# Altium schematic sheet MCU.SchDoc
size A3; Revision: B.2(PCB.SCH)
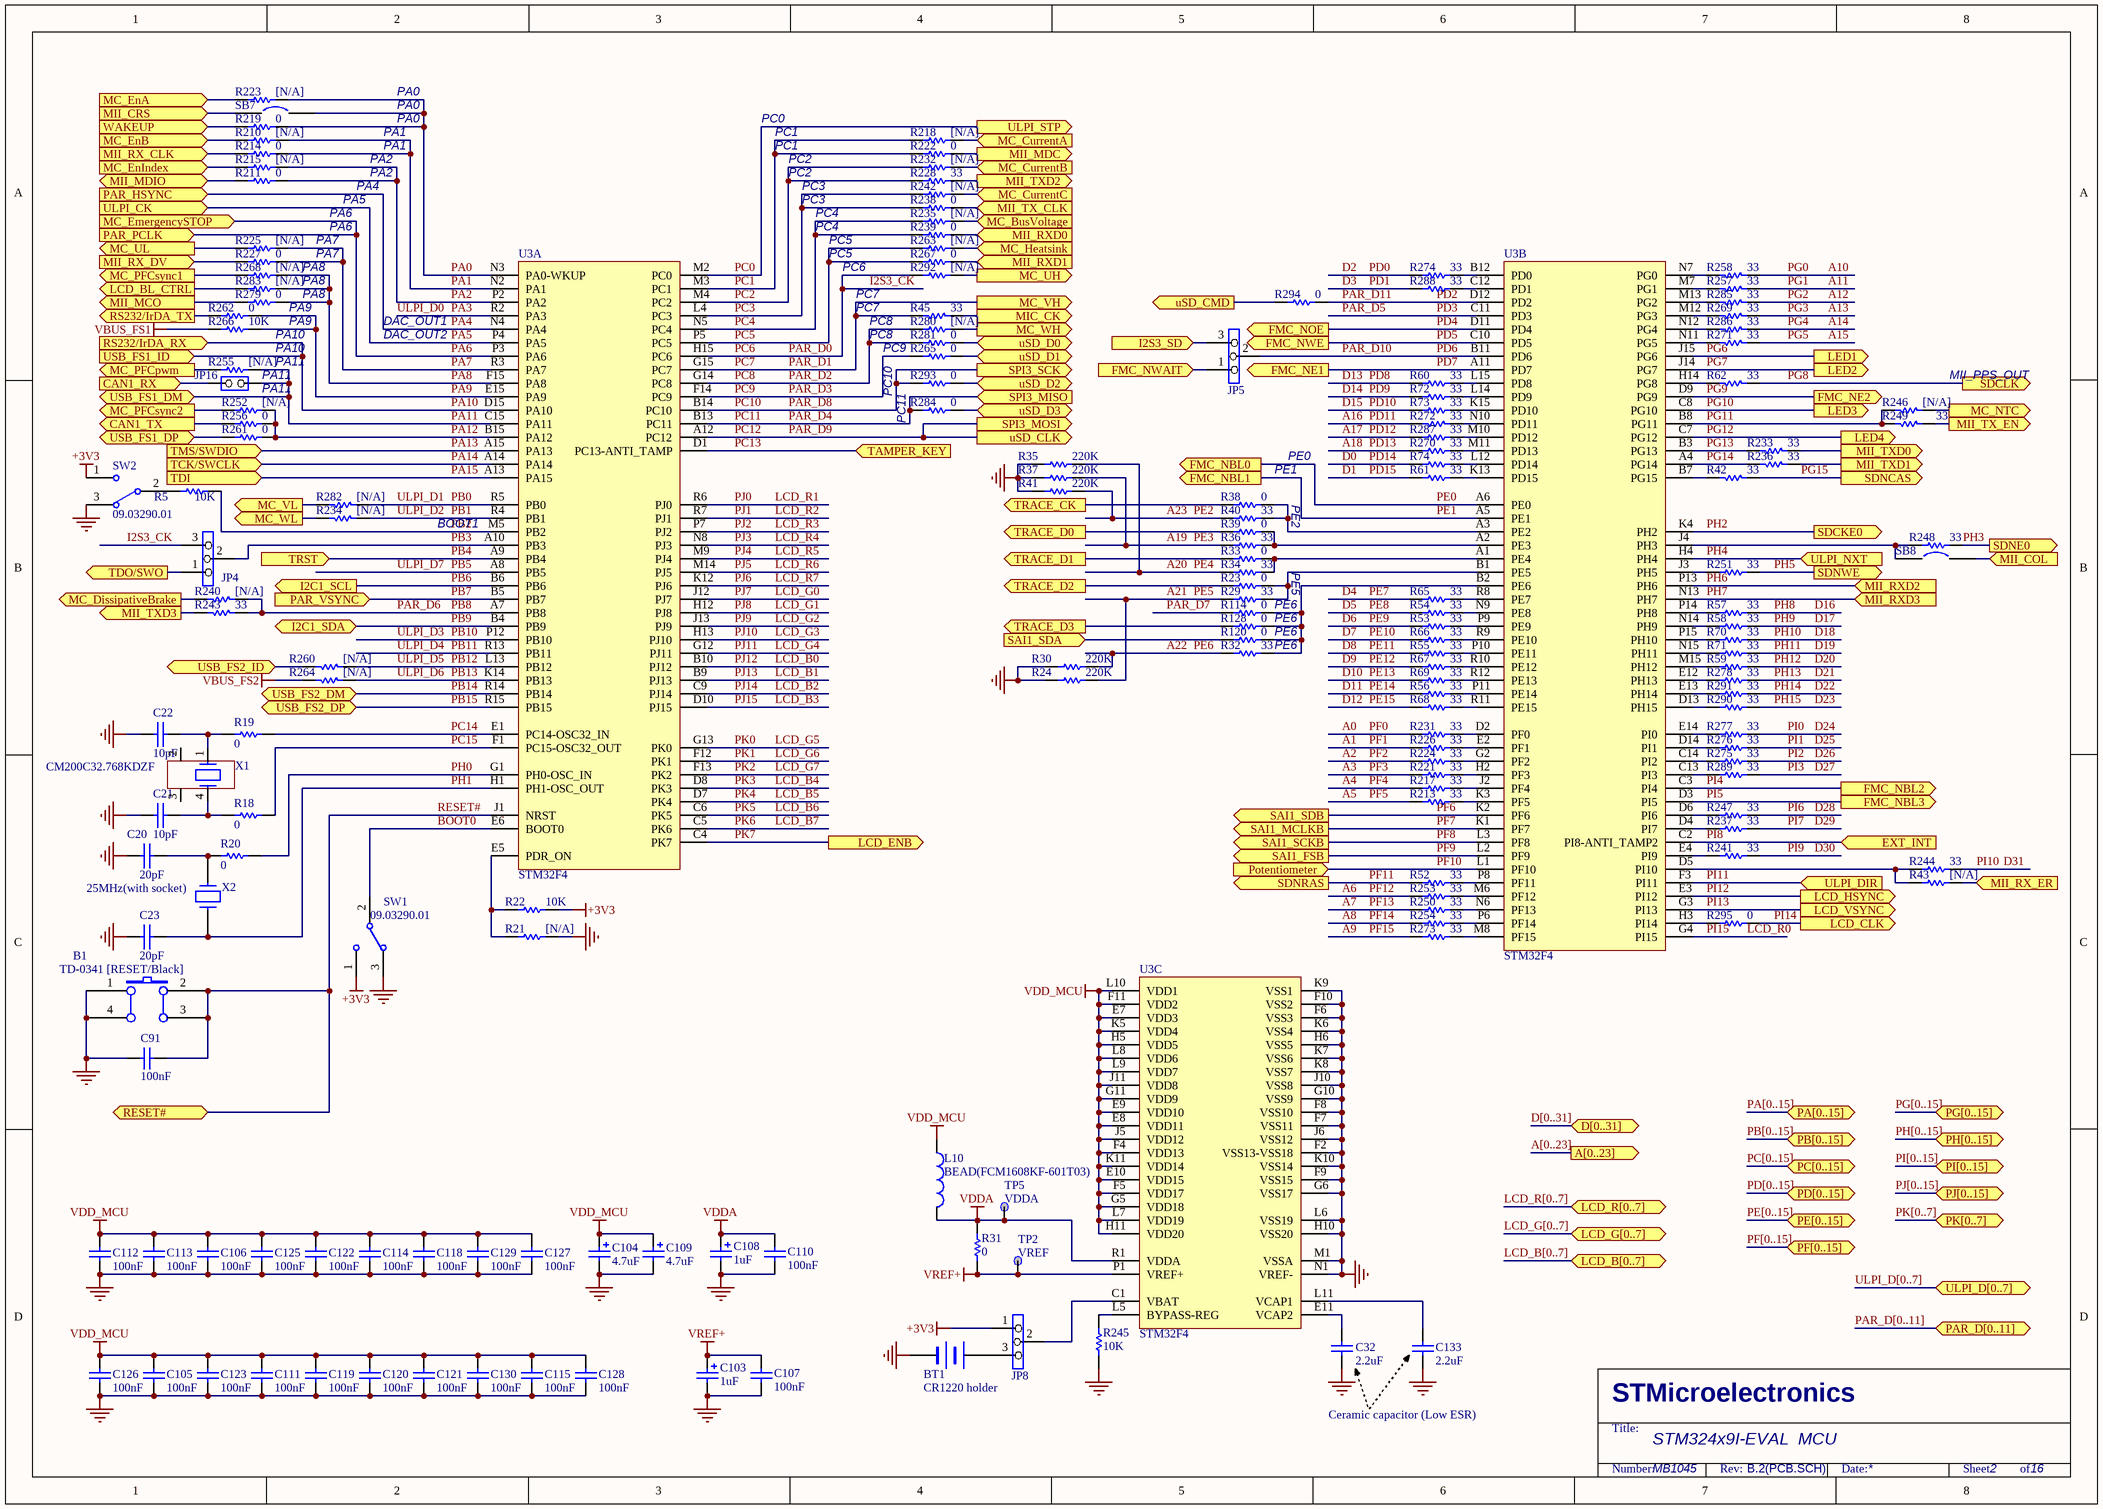
[diagram p0: MCU.SchDoc]

## Parts
B1  TD-0341 [RESET/Black]  [PB10]
BT1  CR1220 holder  [BAT_2SM_CR1220]
C20  20pF  [0603C]
C21  10pF  [0603C]
C22  10pF  [0603C]
C23  20pF  [0603C]
C32  2.2uF  [1206C]
C91  100nF  [0603C]
C103  1uF  [TAN-A]
C104  4.7uF  [TAN-A]
C105  100nF  [0402C]
C106  100nF  [0402C]
C107  100nF  [0402C]
C108  1uF  [TAN-A]
C109  4.7uF  [TAN-A]
C110  100nF  [0402C]
C111  100nF  [0402C]
C112  100nF  [0402C]
C113  100nF  [0402C]
C114  100nF  [0402C]
C115  100nF  [0402C]
C118  100nF  [0402C]
C119  100nF  [0402C]
C120  100nF  [0402C]
C121  100nF  [0402C]
C122  100nF  [0402C]
C123  100nF  [0402C]
C125  100nF  [0402C]
C126  100nF  [0402C]
C127  100nF  [0402C]
C128  100nF  [0402C]
C129  100nF  [0402C]
C130  100nF  [0402C]
C133  2.2uF  [1206C]
JP4  (no value)  [SIP3]
JP5  (no value)  [SIP3]
JP8  (no value)  [SIP3]
JP16  (no value)  [SIP2]
L10  BEAD(FCM1608KF-601T03)  [0603L]
R5  10K  [0603R]
R18  0  [0603R]
R19  0  [0603R]
R20  0  [0603R]
R21  [N/A]  [0603R]
R22  10K  [0603R]
R23  0  [0603R]
R24  220K  [0603R]
R29  33  [0402R]
R30  220K  [0603R]
R31  0  [0603R]
R32  33  [0402R]
R33  0  [0603R]
R34  33  [0402R]
R35  220K  [0603R]
R36  33  [0402R]
R37  220K  [0603R]
R38  0  [0603R]
R39  0  [0603R]
R40  33  [0402R]
R41  220K  [0603R]
R42  33  [0402R]
R43  [N/A]  [0603R]
R45  33  [0603R]
R52  33  [0402R]
R53  33  [0402R]
R54  33  [0402R]
R55  33  [0402R]
R56  33  [0402R]
R57  33  [0402R]
R58  33  [0402R]
R59  33  [0402R]
R60  33  [0402R]
R61  33  [0402R]
R62  33  [0402R]
R65  33  [0402R]
R66  33  [0402R]
R67  33  [0402R]
R68  33  [0402R]
R69  33  [0402R]
R70  33  [0402R]
R71  33  [0402R]
R72  33  [0402R]
R73  33  [0402R]
R74  33  [0402R]
R114  0  [0603R]
R120  0  [0603R]
R128  0  [0603R]
R210  [N/A]  [0603R]
R211  0  [0603R]
R213  33  [0402R]
R214  0  [0603R]
R215  [N/A]  [0603R]
R217  33  [0402R]
R218  [N/A]  [0603R]
R219  0  [0603R]
R221  33  [0402R]
R222  0  [0603R]
R223  [N/A]  [0603R]
R224  33  [0402R]
R225  [N/A]  [0603R]
R226  33  [0402R]
R227  0  [0603R]
R228  33  [0603R]
R231  33  [0402R]
R232  [N/A]  [0603R]
R233  33  [0603R]
R234  [N/A]  [0603R]
R235  [N/A]  [0603R]
R236  33  [0603R]
R237  33  [0402R]
R238  0  [0603R]
R239  0  [0603R]
R240  [N/A]  [0603R]
R241  33  [0402R]
R242  [N/A]  [0603R]
R243  33  [0603R]
R244  33  [0402R]
R245  10K  [0603R]
R246  [N/A]  [0603R]
R247  33  [0402R]
R248  33  [0402R]
R249  33  [0603R]
R250  33  [0402R]
R251  33  [0402R]
R252  [N/A]  [0603R]
R253  33  [0402R]
R254  33  [0402R]
R255  [N/A]  [0603R]
R256  0  [0603R]
R257  33  [0402R]
R258  33  [0402R]
R260  [N/A]  [0603R]
R261  0  [0603R]
R262  0  [0603R]
R263  [N/A]  [0603R]
R264  [N/A]  [0603R]
R265  0  [0603R]
R266  10K  [0603R]
R267  0  [0603R]
R268  [N/A]  [0603R]
R269  33  [0402R]
R270  33  [0402R]
R271  33  [0402R]
R272  33  [0402R]
R273  33  [0402R]
R274  33  [0402R]
R275  33  [0402R]
R276  33  [0402R]
R277  33  [0402R]
R278  33  [0402R]
R279  0  [0603R]
R280  [N/A]  [0603R]
R281  0  [0603R]
R282  [N/A]  [0603R]
R283  [N/A]  [0603R]
R284  0  [0603R]
R285  33  [0402R]
R286  33  [0402R]
R287  33  [0402R]
R288  33  [0402R]
R289  33  [0402R]
R290  33  [0402R]
R291  33  [0402R]
R292  [N/A]  [0603R]
R293  0  [0603R]
R294  0  [0603R]
R295  0  [0603R]
SB7  (no value)  [JP2_SMD]
SB8  (no value)  [JP2_SMD]
SW1  09.03290.01  [SW1_3TH_2R54_10X2R5]
SW2  09.03290.01  [SW1_3TH_2R54_10X2R5]
TP2  VREF  [TP]
TP5  VDDA  [TP]
U3  STM32F4  [BGA216_0R8_13X13_SKT]  (parts A,B,C of 3)
X1  CM200C32.768KDZF  [XTAL_4SM_8X3R8]
X2  25MHz(with socket)  [XTAL_socket]

## Ports
A[0..23] (out), CAN1_RX (in), CAN1_TX (out), D[0..31] (bidir), EXT_INT (in), FMC_NBL0 (out), FMC_NBL1 (out), FMC_NBL2 (out), FMC_NBL3 (out), FMC_NE1 (out), FMC_NE2 (out), FMC_NOE (out), FMC_NWAIT (in), FMC_NWE (out), I2C1_SCL (out), I2C1_SDA (bidir), I2S3_SD (in), LCD_B[0..7] (bidir), LCD_BL_CTRL (out), LCD_CLK (out), LCD_ENB (out), LCD_G[0..7] (bidir), LCD_HSYNC (out), LCD_R[0..7] (bidir), LCD_VSYNC (out), LED1 (out), LED2 (out), LED3 (out), LED4 (out), MC_BusVoltage (in), MC_CurrentA (in), MC_CurrentB (in), MC_CurrentC (in), MC_DissipativeBrake (out), MC_EmergencySTOP (in), MC_EnA (in), MC_EnB (in), MC_EnIndex (in), MC_Heatsink (in), MC_NTC (out), MC_PFCpwm (out), MC_PFCsync1 (out), MC_PFCsync2 (out), MC_UH (out), MC_UL (out), MC_VH (out), MC_VL (out), MC_WH (out), MC_WL (out), MIC_CK (out), MII_COL (in), MII_CRS (in), MII_MCO (out), MII_MDC (out), MII_MDIO (bidir), MII_RX_CLK (in), MII_RX_DV (in), MII_RX_ER (in), MII_RXD0 (in), MII_RXD1 (in), MII_RXD2 (in), MII_RXD3 (in), MII_TX_CLK (in), MII_TX_EN (out), MII_TXD0 (out), MII_TXD1 (out), MII_TXD2 (out), MII_TXD3 (out), PA[0..15] (bidir), PAR_D[0..11] (bidir), PAR_HSYNC (in), PAR_PCLK (in), PAR_VSYNC (in), PB[0..15] (bidir), PC[0..15] (bidir), PD[0..15] (bidir), PE[0..15] (bidir), PF[0..15] (bidir), PG[0..15] (bidir), PH[0..15] (bidir), PI[0..15] (bidir), PJ[0..15] (bidir), PK[0..7] (bidir), Potentiometer (in), RESET# (bidir), RS232/IrDA_RX (in), RS232/IrDA_TX (out), SAI1_FSB (out), SAI1_MCLKB (out), SAI1_SCKB (out), SAI1_SDA (in), SAI1_SDB (out), SDCKE0 (out), SDCLK (out), SDNCAS (out), SDNE0 (out), SDNRAS (out), SDNWE (out), SPI3_MISO (in), SPI3_MOSI (out), SPI3_SCK (out), TAMPER_KEY (in), TCK/SWCLK (in), TDI (in), TDO/SWO (out), TMS/SWDIO (in), TRACE_CK (out), TRACE_D0 (out), TRACE_D1 (out), TRACE_D2 (out), TRACE_D3 (out), TRST (in), ULPI_CK (in), ULPI_D[0..7] (bidir), ULPI_DIR (in), ULPI_NXT (in), ULPI_STP (out), USB_FS1_DM (bidir), USB_FS1_DP (bidir), USB_FS1_ID (in), USB_FS2_DM (bidir), USB_FS2_DP (bidir), USB_FS2_ID (bidir), uSD_CLK (out), uSD_CMD (out), uSD_D0 (bidir), uSD_D1 (bidir), uSD_D2 (bidir), uSD_D3 (bidir), WAKEUP (in)

## Nets
+3V3: JP8.1 R22.2 SW1.1 SW2.1
GND: B1.1(A0) B1.4(A1) BT1.2(-) C20.2 C21.2 C22.2 C23.2 C32.2 C91.1 C103.2 C104.2 C105.2 C106.2 C107.1 C108.2 C109.2 C110.1 C111.2 C112.2 C113.2 C114.2 C115.2 C118.2 C119.2 C120.2 C121.2 C122.2 C123.2 C125.2 C126.2 C127.2 C128.2 C129.2 C130.2 C133.2 R21.2 R24.1 R30.1 R35.1 R37.1 R41.1 R245.1 SW1.3 SW2.3 U3.F2(VSS13-VSS18) U3.F6(VSS3) U3.F7(VSS11) U3.F8(VSS10) U3.F9(VSS15) U3.F10(VSS2) U3.G6(VSS17) U3.G10(VSS9) U3.H6(VSS5) U3.H10(VSS20) U3.J6(VSS12) U3.J10(VSS8) U3.K6(VSS4) U3.K7(VSS6) U3.K8(VSS7) U3.K9(VSS1) U3.K10(VSS14) U3.L6(VSS19) U3.M1(VSSA) U3.N1(VREF-)
VBUS_FS1: R266.2
VBUS_FS2: R264.1
VDD_MCU: C104.1 C105.1 C106.1 C109.1 C111.1 C112.1 C113.1 C114.1 C115.1 C118.1 C119.1 C120.1 C121.1 C122.1 C123.1 C125.1 C126.1 C127.1 C128.1 C129.1 C130.1 L10.1 U3.E7(VDD3) U3.E8(VDD11) U3.E9(VDD10) U3.E10(VDD15) U3.F4(VDD13) U3.F5(VDD17) U3.F11(VDD2) U3.G5(VDD18) U3.G11(VDD9) U3.H5(VDD5) U3.H11(VDD20) U3.J5(VDD12) U3.J11(VDD8) U3.K5(VDD4) U3.K11(VDD14) U3.L7(VDD19) U3.L8(VDD6) U3.L9(VDD7) U3.L10(VDD1)
VDDA: C108.1 C110.2 L10.2 R31.1 TP5.1 U3.R1(VDDA)
VREF+: C103.1 C107.2 R31.2 TP2.1 U3.P1(VREF+)
A0: R231.2  [also labelled PF0]
A1: R226.2  [also labelled PF1]
A2: R224.2  [also labelled PF2]
A3: R221.2  [also labelled PF3]
A4: R217.2  [also labelled PF4]
A5: R213.2  [also labelled PF5]
A6: R253.2  [also labelled PF12]
A7: R250.2  [also labelled PF13]
A8: R254.2  [also labelled PF14]
A9: R273.2  [also labelled PF15]
A10: R258.2  [also labelled PG0]
A11: R257.2  [also labelled PG1]
A12: R285.2  [also labelled PG2]
A13: R269.2  [also labelled PG3]
A14: R286.2  [also labelled PG4]
A15: R271.2  [also labelled PG5]
A16: R272.1  [also labelled PD11]
A17: R287.2  [also labelled PD12]
A18: R270.2  [also labelled PD13]
A19: R36.2 R37.2  [also labelled PE3]
A20: R34.2 R35.2  [also labelled PE4]
A21: R24.2 R29.2  [also labelled PE5]
A22: R30.2 R32.2  [also labelled PE6]
A23: R40.2 R41.2  [also labelled PE2]
BOOT0: SW1.2 U3.E6(BOOT0)
CAN1_RX: JP16.2(NO) ; port CAN1_RX
CAN1_TX: R256.2 ; port CAN1_TX
D0: R74.2  [also labelled PD14]
D1: R61.2  [also labelled PD15]
D2: R274.2  [also labelled PD0]
D3: R288.2  [also labelled PD1]
D4: R65.2  [also labelled PE7]
D5: R54.2  [also labelled PE8]
D6: R53.2  [also labelled PE9]
D7: R66.2  [also labelled PE10]
D8: R55.2  [also labelled PE11]
D9: R67.2  [also labelled PE12]
D10: R69.2  [also labelled PE13]
D11: R56.2  [also labelled PE14]
D12: R68.2  [also labelled PE15]
D13: R60.2  [also labelled PD8]
D14: R72.2  [also labelled PD9]
D15: R73.2  [also labelled PD10]
D16: R57.1  [also labelled PH8]
D17: R58.1  [also labelled PH9]
D18: R70.1  [also labelled PH10]
D19: R71.1  [also labelled PH11]
D20: R59.1  [also labelled PH12]
D21: R278.1  [also labelled PH13]
D22: R291.1  [also labelled PH14]
D23: R290.1  [also labelled PH15]
D24: R277.1  [also labelled PI0]
D25: R276.1  [also labelled PI1]
D26: R275.1  [also labelled PI2]
D27: R289.1  [also labelled PI3]
D28: R247.1  [also labelled PI6]
D29: R237.1  [also labelled PI7]
D30: R241.1  [also labelled PI9]
D31: R244.1  [also labelled PI10]
FMC_NWAIT: JP5.1 ; port FMC_NWAIT
I2S3_CK: JP4.3 R292.2 U3.H15(PC6)  [also labelled PAR_D0, PC6]
I2S3_SD: JP5.3 ; port I2S3_SD
LCD_B0: U3.B10(PJ12)  [also labelled PJ12]
LCD_B1: U3.B9(PJ13)  [also labelled PJ13]
LCD_B2: U3.C9(PJ14)  [also labelled PJ14]
LCD_B3: U3.D10(PJ15)  [also labelled PJ15]
LCD_B4: U3.D8(PK3)  [also labelled PK3]
LCD_B5: U3.D7(PK4)  [also labelled PK4]
LCD_B6: U3.C6(PK5)  [also labelled PK5]
LCD_B7: U3.C5(PK6)  [also labelled PK6]
LCD_BL_CTRL: R283.2 ; port LCD_BL_CTRL
LCD_G0: U3.J12(PJ7)  [also labelled PJ7]
LCD_G1: U3.H12(PJ8)  [also labelled PJ8]
LCD_G2: U3.J13(PJ9)  [also labelled PJ9]
LCD_G3: U3.H13(PJ10)  [also labelled PJ10]
LCD_G4: U3.G12(PJ11)  [also labelled PJ11]
LCD_G5: U3.G13(PK0)  [also labelled PK0]
LCD_G6: U3.F12(PK1)  [also labelled PK1]
LCD_G7: U3.F13(PK2)  [also labelled PK2]
LCD_R0: U3.G4(PI15)  [also labelled PI15]
LCD_R1: U3.R6(PJ0)  [also labelled PJ0]
LCD_R2: U3.R7(PJ1)  [also labelled PJ1]
LCD_R3: U3.P7(PJ2)  [also labelled PJ2]
LCD_R4: U3.N8(PJ3)  [also labelled PJ3]
LCD_R5: U3.M9(PJ4)  [also labelled PJ4]
LCD_R6: U3.M14(PJ5)  [also labelled PJ5]
LCD_R7: U3.K12(PJ6)  [also labelled PJ6]
MC_BusVoltage: R235.1 ; port MC_BusVoltage
MC_CurrentA: R218.1 ; port MC_CurrentA
MC_CurrentB: R232.1 ; port MC_CurrentB
MC_CurrentC: R242.1 ; port MC_CurrentC
MC_DissipativeBrake: R240.1 ; port MC_DissipativeBrake
MC_EnA: R223.2 ; port MC_EnA
MC_EnB: R210.2 ; port MC_EnB
MC_EnIndex: R215.2 ; port MC_EnIndex
MC_Heatsink: R263.1 ; port MC_Heatsink
MC_NTC: R246.2 ; port MC_NTC
MC_PFCpwm: R255.2 ; port MC_PFCpwm
MC_PFCsync1: R268.2 ; port MC_PFCsync1
MC_PFCsync2: R252.2 ; port MC_PFCsync2
MC_UH: R292.1 ; port MC_UH
MC_UL: R225.2 ; port MC_UL
MC_VL: R282.1 ; port MC_VL
MC_WH: R280.1 ; port MC_WH
MC_WL: R234.1 ; port MC_WL
MIC_CK: R45.2 ; port MIC_CK
MII_COL: SB8.2 ; port MII_COL
MII_CRS: SB7.1 ; port MII_CRS
MII_MCO: R279.2 ; port MII_MCO
MII_MDC: R222.1 ; port MII_MDC
MII_MDIO: R211.2 ; port MII_MDIO
MII_RX_CLK: R214.2 ; port MII_RX_CLK
MII_RX_DV: R227.2 ; port MII_RX_DV
MII_RX_ER: R43.1 ; port MII_RX_ER
MII_RXD0: R239.1 ; port MII_RXD0
MII_RXD1: R267.1 ; port MII_RXD1
MII_TX_CLK: R238.1 ; port MII_TX_CLK
MII_TX_EN: R249.2 ; port MII_TX_EN
MII_TXD0: R233.2 ; port MII_TXD0
MII_TXD1: R236.2 ; port MII_TXD1
MII_TXD2: R228.1 ; port MII_TXD2
MII_TXD3: R243.1 ; port MII_TXD3
PA0: R219.1 R223.1 SB7.2 U3.N3(PA0-WKUP)
PA1: R210.1 R214.1 U3.N2(PA1)
PA2: R211.1 R215.1 U3.P2(PA2)
PA3: U3.R2(PA3)  [also labelled ULPI_D0]
PA4: U3.N4(PA4) ; port PAR_HSYNC
PA5: U3.P4(PA5) ; port ULPI_CK
PA6: U3.P3(PA6) ; port MC_EmergencySTOP, port PAR_PCLK
PA7: R225.1 R227.1 U3.R3(PA7)
PA8: R268.1 R279.1 R283.1 U3.F15(PA8)
PA9: R262.1 R266.1 U3.E15(PA9)
PA10: U3.D15(PA10) ; port RS232/IrDA_RX, port USB_FS1_ID
PA11: JP16.1(COMMON) R255.1 U3.C15(PA11) ; port USB_FS1_DM
PA12: R252.1 R256.1 R261.1 U3.B15(PA12)
PA13: U3.A15(PA13) ; port TMS/SWDIO
PA14: U3.A14(PA14) ; port TCK/SWCLK
PA15: U3.A13(PA15) ; port TDI
PAR_D1: R45.1 U3.G15(PC7) ; port MC_VH  [also labelled PC7]
PAR_D2: R280.2 R281.2 U3.G14(PC8)  [also labelled PC8]
PAR_D3: R265.2 U3.F14(PC9)  [also labelled PC9]
PAR_D4: R284.2 U3.B13(PC11) ; port SPI3_MISO  [also labelled PC11]
PAR_D5: U3.C11(PD3)  [also labelled PD3]
PAR_D6: R240.2 R243.2 U3.A7(PB8)  [also labelled PB8]
PAR_D7: R114.1
PAR_D8: R293.2 U3.B14(PC10) ; port SPI3_SCK  [also labelled PC10]
PAR_D9: U3.A12(PC12) ; port uSD_CLK, port SPI3_MOSI  [also labelled PC12]
PAR_D10: JP5.2 U3.B11(PD6)  [also labelled PD6]
PAR_D11: R294.2 U3.D12(PD2)  [also labelled PD2]
PB0: R282.2 U3.R5(PB0)  [also labelled ULPI_D1]
PB1: R234.2 U3.R4(PB1)  [also labelled ULPI_D2]
PB2: R5.2 U3.M5(PB2)
PB3: JP4.2 U3.A10(PB3)
PB4: U3.A9(PB4) ; port TRST
PB5: U3.A8(PB5)  [also labelled ULPI_D7]
PB6: U3.B6(PB6) ; port I2C1_SCL
PB7: U3.B5(PB7) ; port PAR_VSYNC
PB9: U3.B4(PB9) ; port I2C1_SDA
PB10: U3.P12(PB10)  [also labelled ULPI_D3]
PB11: U3.R13(PB11)  [also labelled ULPI_D4]
PB12: R260.2 U3.L13(PB12)  [also labelled ULPI_D5]
PB13: R264.2 U3.K14(PB13)  [also labelled ULPI_D6]
PB14: U3.R14(PB14) ; port USB_FS2_DM
PB15: U3.R15(PB15) ; port USB_FS2_DP
PC0: U3.M2(PC0) ; port ULPI_STP
PC1: R218.2 R222.2 U3.M3(PC1)
PC2: R228.2 R232.2 U3.M4(PC2)
PC3: R238.2 R242.2 U3.L4(PC3)
PC4: R235.2 R239.2 U3.N5(PC4)
PC5: R263.2 R267.2 U3.P5(PC5)
PC13: U3.D1(PC13-ANTI_TAMP) ; port TAMPER_KEY
PC14: R19.2 U3.E1(PC14-OSC32_IN)
PC15: R18.2 U3.F1(PC15-OSC32_OUT)
PD4: U3.D11(PD4) ; port FMC_NOE
PD5: U3.C10(PD5) ; port FMC_NWE
PD7: U3.A11(PD7) ; port FMC_NE1
PE0: U3.A6(PE0) ; port FMC_NBL0
PE1: U3.A5(PE1) ; port FMC_NBL1
PF6: U3.K2(PF6) ; port SAI1_SDB
PF7: U3.K1(PF7) ; port SAI1_MCLKB
PF8: U3.L3(PF8) ; port SAI1_SCKB
PF9: U3.L2(PF9) ; port SAI1_FSB
PF10: U3.L1(PF10) ; port Potentiometer
PF11: R52.2 ; port SDNRAS
PG6: U3.J15(PG6) ; port LED1
PG7: U3.J14(PG7) ; port LED2
PG8: R62.2 ; port SDCLK
PG9: U3.D9(PG9) ; port FMC_NE2
PG10: U3.C8(PG10) ; port LED3
PG11: R246.1 R249.1 U3.B8(PG11)
PG12: U3.C7(PG12) ; port LED4
PG13: R233.1 U3.B3(PG13)
PG14: R236.1 U3.A4(PG14)
PG15: R42.2 ; port SDNCAS
PH0: R20.1 U3.G1(PH0-OSC_IN)
PH1: C23.1 U3.H1(PH1-OSC_OUT) X2.1
PH2: U3.K4(PH2) ; port SDCKE0
PH3: R248.1 ; port SDNE0
PH4: U3.H4(PH4) ; port ULPI_NXT
PH5: R251.1 ; port SDNWE
PH6: U3.P13(PH6) ; port MII_RXD2
PH7: U3.N13(PH7) ; port MII_RXD3
PI4: U3.C3(PI4) ; port FMC_NBL2
PI5: U3.D3(PI5) ; port FMC_NBL3
PI8: U3.C2(PI8-ANTI_TAMP2) ; port EXT_INT
PI11: U3.F3(PI11) ; port ULPI_DIR
PI12: U3.E3(PI12) ; port LCD_HSYNC
PI13: U3.G3(PI13) ; port LCD_VSYNC
PI14: R295.1 ; port LCD_CLK
PK7: U3.C4(PK7) ; port LCD_ENB
RESET#: B1.2(B0) B1.3(B1) C91.2 U3.J1(NRST) ; port RESET#
RS232/IrDA_TX: R262.2 ; port RS232/IrDA_TX
SAI1_SDA: R120.2 ; port SAI1_SDA
TDO/SWO: JP4.1 ; port TDO/SWO
TRACE_CK: R38.1 ; port TRACE_CK
TRACE_D0: R39.1 ; port TRACE_D0
TRACE_D1: R33.1 ; port TRACE_D1
TRACE_D2: R23.1 ; port TRACE_D2
TRACE_D3: R128.1 ; port TRACE_D3
USB_FS1_DP: R261.2 ; port USB_FS1_DP
USB_FS2_ID: R260.1 ; port USB_FS2_ID
uSD_CMD: R294.1 ; port uSD_CMD
uSD_D0: R281.1 ; port uSD_D0
uSD_D1: R265.1 ; port uSD_D1
uSD_D2: R293.1 ; port uSD_D2
uSD_D3: R284.1 ; port uSD_D3
WAKEUP: R219.2 ; port WAKEUP
NetBT1_1: BT1.1(+) JP8.3
NetC20_1: C20.1 R20.2 X2.2
NetC21_1: C21.1 R18.1 X1.4
NetC22_1: C22.1 R19.1 X1.1
NetC32_1: C32.1 U3.E11(VCAP2)
NetC133_1: C133.1 U3.L11(VCAP1)
NetJP8_2: JP8.2 U3.C1(VBAT)
NetR5_1: R5.1 SW2.2
NetR21_1: R21.1 R22.1 U3.E5(PDR_ON)
NetR23_2: R23.2 R29.1 U3.B1(PE5)
NetR32_1: R32.1 R114.2 R120.1 R128.2 U3.B2(PE6)
NetR33_2: R33.2 R34.1 U3.A1(PE4)
NetR36_1: R36.1 R39.2 U3.A2(PE3)
NetR38_2: R38.2 R40.1 U3.A3(PE2)
NetR42_1: R42.1 U3.B7(PG15)
NetR43_2: R43.2 R244.2 U3.D5(PI10)
NetR52_1: R52.1 U3.P8(PF11)
NetR53_1: R53.1 U3.P9(PE9)
NetR54_1: R54.1 U3.N9(PE8)
NetR55_1: R55.1 U3.P10(PE11)
NetR56_1: R56.1 U3.P11(PE14)
NetR57_2: R57.2 U3.P14(PH8)
NetR58_2: R58.2 U3.N14(PH9)
NetR59_2: R59.2 U3.M15(PH12)
NetR60_1: R60.1 U3.L15(PD8)
NetR61_1: R61.1 U3.K13(PD15)
NetR62_1: R62.1 U3.H14(PG8)
NetR65_1: R65.1 U3.R8(PE7)
NetR66_1: R66.1 U3.R9(PE10)
NetR67_1: R67.1 U3.R10(PE12)
NetR68_1: R68.1 U3.R11(PE15)
NetR69_1: R69.1 U3.R12(PE13)
NetR70_2: R70.2 U3.P15(PH10)
NetR71_2: R71.2 U3.N15(PH11)
NetR72_1: R72.1 U3.L14(PD9)
NetR73_1: R73.1 U3.K15(PD10)
NetR74_1: R74.1 U3.L12(PD14)
NetR213_1: R213.1 U3.K3(PF5)
NetR217_1: R217.1 U3.J2(PF4)
NetR221_1: R221.1 U3.H2(PF3)
NetR224_1: R224.1 U3.G2(PF2)
NetR226_1: R226.1 U3.E2(PF1)
NetR231_1: R231.1 U3.D2(PF0)
NetR237_2: R237.2 U3.D4(PI7)
NetR241_2: R241.2 U3.E4(PI9)
NetR245_2: R245.2 U3.L5(BYPASS-REG)
NetR247_2: R247.2 U3.D6(PI6)
NetR248_2: R248.2 SB8.1 U3.J4(PH3)
NetR250_1: R250.1 U3.N6(PF13)
NetR251_2: R251.2 U3.J3(PH5)
NetR253_1: R253.1 U3.M6(PF12)
NetR254_1: R254.1 U3.P6(PF14)
NetR257_1: R257.1 U3.M7(PG1)
NetR258_1: R258.1 U3.N7(PG0)
NetR269_1: R269.1 U3.M12(PG3)
NetR270_1: R270.1 U3.M11(PD13)
NetR271_1: R271.1 U3.N11(PG5)
NetR272_2: R272.2 U3.N10(PD11)
NetR273_1: R273.1 U3.M8(PF15)
NetR274_1: R274.1 U3.B12(PD0)
NetR275_2: R275.2 U3.C14(PI2)
NetR276_2: R276.2 U3.D14(PI1)
NetR277_2: R277.2 U3.E14(PI0)
NetR278_2: R278.2 U3.E12(PH13)
NetR285_1: R285.1 U3.M13(PG2)
NetR286_1: R286.1 U3.N12(PG4)
NetR287_1: R287.1 U3.M10(PD12)
NetR288_1: R288.1 U3.C12(PD1)
NetR289_2: R289.2 U3.C13(PI3)
NetR290_2: R290.2 U3.D13(PH15)
NetR291_2: R291.2 U3.E13(PH14)
NetR295_2: R295.2 U3.H3(PI14)

Not connected (* = marked no-connect by the designer): X1 2 3

## Buses and harness runs
bus A[0..23] = port A[0..23]
bus D[0..31] = port D[0..31]
bus LCD_B[0..7] = port LCD_B[0..7]
bus LCD_G[0..7] = port LCD_G[0..7]
bus LCD_R[0..7] = port LCD_R[0..7]
bus PA[0..15] = port PA[0..15]
bus PAR_D[0..11] = port PAR_D[0..11]
bus PB[0..15] = port PB[0..15]
bus PC[0..15] = port PC[0..15]
bus PD[0..15] = port PD[0..15]
bus PE[0..15] = port PE[0..15]
bus PF[0..15] = port PF[0..15]
bus PG[0..15] = port PG[0..15]
bus PH[0..15] = port PH[0..15]
bus PI[0..15] = port PI[0..15]
bus PJ[0..15] = port PJ[0..15]
bus PK[0..7] = port PK[0..7]
bus ULPI_D[0..7] = port ULPI_D[0..7]

## Notes on the sheet
- PA0
- PA2
- PA1
- PC0
- PC1
- PC2
- PA7
- PA6
- PA5
- PA4
- PC3
- PC4
- PC5
- PA9
- PA8
- PC6
- PC7
- PA11
- PA10
- DAC_OUT1
- DAC_OUT2
- PC8
- PC9
- MII_PPS_OUT
- PC10
- PC11
- PE1
- PE0
- PE2
- BOOT1
- PE5
- PE6
- Ceramic capacitor (Low ESR)
- STM324x9I-EVAL  MCU
- MB1045
- 2
- 16
- STMicroelectronics
- Title:
- Number:
- Rev:
- Date:
- Sheet          of

## Library data of the parts
B1 = SW PUSHBUTTON: SE PUSHBUTTON
BT1 = BATTERY
C20-C23 C105 C106 C111-C115 C118-C123 C125-C130 = CAP: Capacitor
  C105 C106 C111-C115 C118-C123 C125-C130: Published: 8-Jun-2000; Revision: July-2002: Re-released for DXP Platform.; Publisher: Altium Limited; Value: 100nF
C32 C107 C110 C133 = Cap: Capacitor; Value: 10nF; Published: 8-Jun-2000; Revision: July-2002: Re-released for DXP Platform.; Publisher: Altium Limited
C91 = CAP: Capacitor; Value: 100pF; Published: 8-Jun-2000; Revision: July-2002: Re-released for DXP Platform.; Publisher: Altium Limited
C103 C108 = Cap Pol1: Polarized Capacitor (Radial); Value: 10uF; Published: 8-Jun-2000; Revision: July-2002: Re-released for DXP Platform.; Publisher: Altium Limited
C104 C109 = Cap Pol1: Polarized Capacitor (Radial); Value: 47uF; Published: 8-Jun-2000; Revision: July-2002: Re-released for DXP Platform.; Publisher: Altium Limited
JP4 JP5 JP8 = Jumper3
JP16 = JP2
L10 = Inductor: Value: 100uH; Published: 8-Jun-2000; Revision: July-2002: Re-released for DXP Platform.; Publisher: Altium Limited
R5 R18-R23 R29 R31-R34 R36 R38-R40 R42 R43 R45 R52-R62 R65-R74 R114 R120 R128 R210 R211 R213-R215 R217-R219 R221-R228 R231-R258 R260-R265 R267-R295 = Res1: Resistor; Value: 1K; Published: 8-Jun-2000; Revision: July-2002: Re-released for DXP Platform.; Publisher: Altium Limited
R24 R30 R35 R37 R41 R266 = res1: Resistor; Value: 1K; Published: 8-Jun-2000; Revision: July-2002: Re-released for DXP Platform.; Publisher: Altium Limited
SB7 SB8 = Circuit Breaker: Published: 24-Mar-1999; Revision: July-2002: Re-released for DXP Platform.; Publisher: Altium Limited
SW1 SW2 = SW-SPDT: SPDT Subminiature Toggle Switch, Right Angle Mounting, Vertical Actuation; Revision 1: Jul-2002: Re-released for DXP Platform.; Revision 2: 17-Dec-2003: Schematic revised, PCB Footprint replaced.; Published: 24-Mar-1999; Datasheet: Latest Revision: 05-Dec-2000; Publisher: Altium Limited
TP2 TP5 = TP
U3 = Big_Manta_TFBGA216
X1 = MC306
X2 = CRYSTAL